# EAGLE design max485 (EAGLE 6.1)
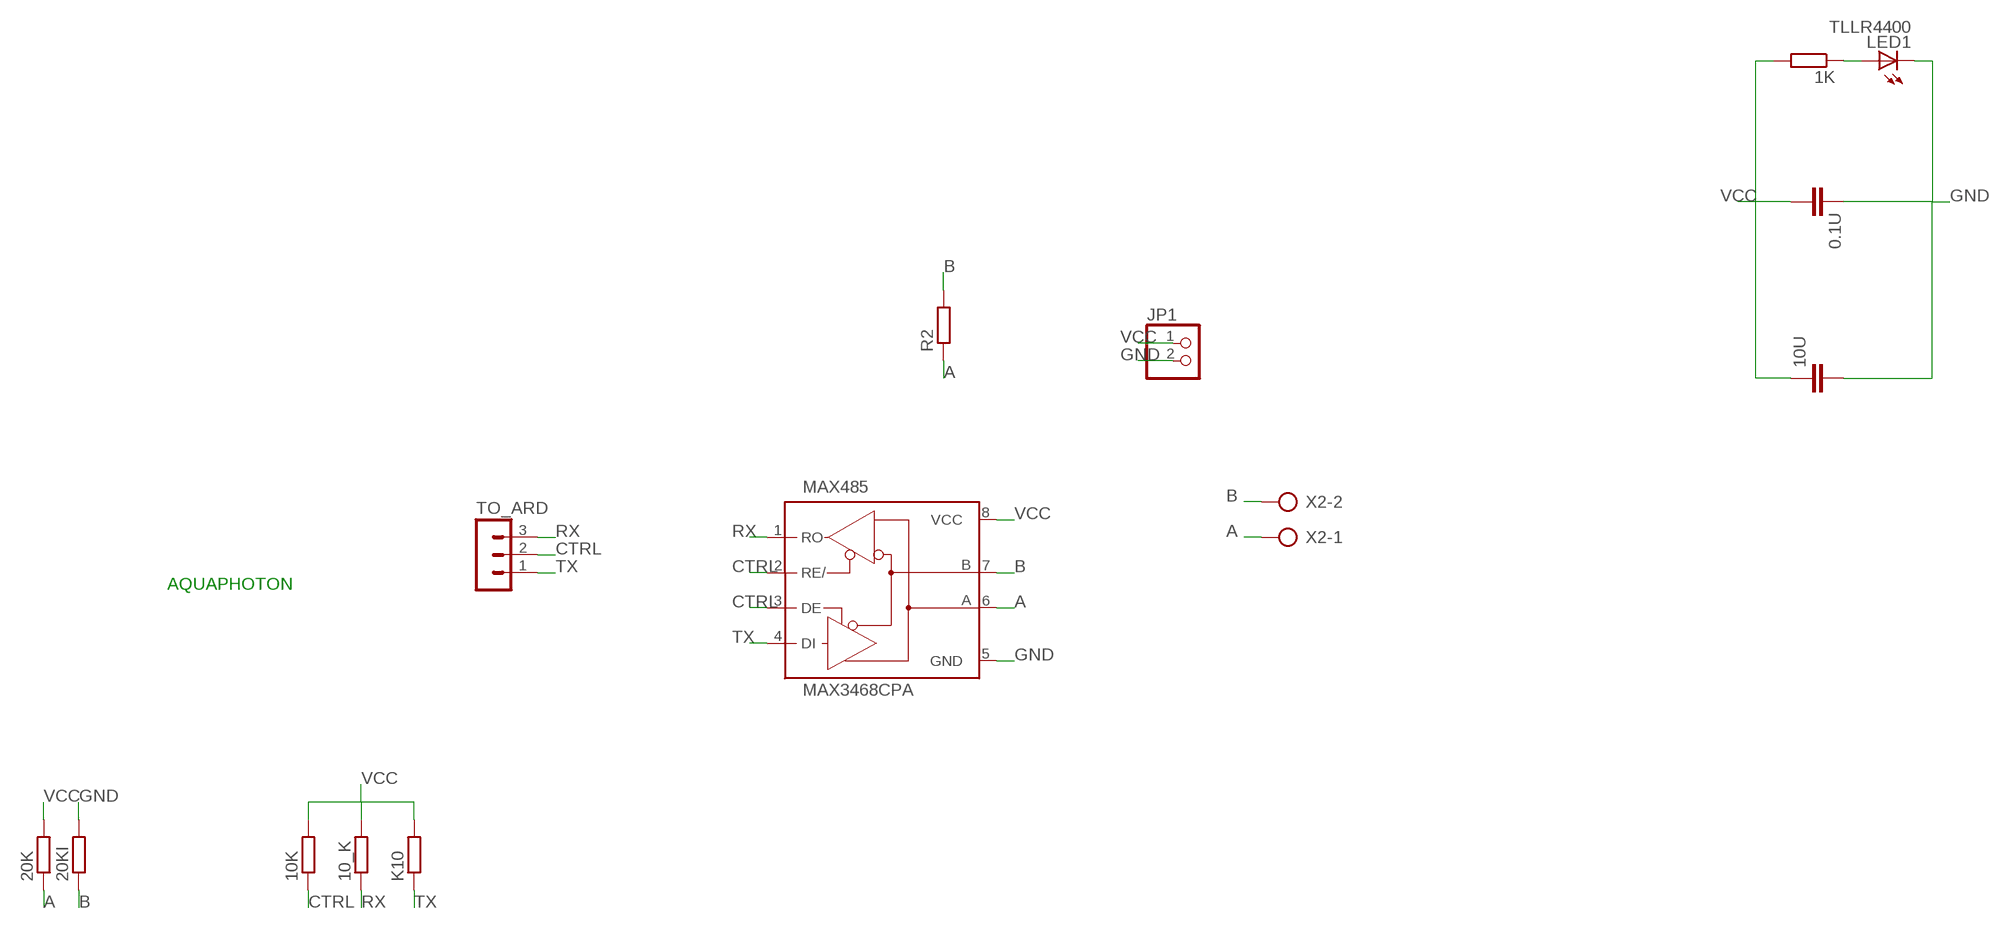
[diagram p0: schematic, sheet 1]

## Parts
0.1U  C5/2.5  [C5B2.5]
1K  R-EU_0207/10  [0207/10]
10_K  R-EU_0207/10  [0207/10]
10K  R-EU_0207/10  [0207/10]
10U  C5/2.5  [C5B2.5]
20K  R-EU_0207/10  [0207/10]
20KI  R-EU_0207/10  [0207/10]
JP1  PINHD-1X2  [1X02]
K10  R-EU_0207/10  [0207/10]
LED1  TLLR4400  [LED3MM]
MAX485  MAX3468CPA  [DIL08]
R2  R-EU_0207/10  [0207/10]
TO_ARD  MA03-1  [MA03-1]
X2  AK500/2-H  [AK500/2-H]

## Nets
A: 20K.1 MAX485.6(A) R2.1 X2.1
B: 20KI.1 MAX485.7(B) R2.2 X2.2
CTRL: 10K.1 MAX485.2(RE/) MAX485.3(DE) TO_ARD.2
GND: 0.1U.1 10U.2 20KI.2 JP1.2 LED1.K(C) MAX485.5(GND)
N$2: 1K.1 LED1.A
RX: 10_K.1 MAX485.1(RO) TO_ARD.3
TX: K10.1 MAX485.4(DI) TO_ARD.1
VCC: 0.1U.2 1K.2 10_K.2 10K.2 10U.1 20K.2 JP1.1 K10.2 MAX485.8(VCC)

## Notes on the sheet
- AQUAPHOTON

## Library data of the parts
0.1U 10U = capacitor-wima:C: CAPACITOR naming: grid - package width
1K 10_K 10K 20K 20KI K10 R2 = rcl:R-EU_: RESISTOR, European symbol
JP1 = pinhead:PINHD-1X2: PIN HEADER
LED1 = led:TLLR4400: Low Current (2mA) LED 3 mm Tinted Diffused Package color RED Source: Data sheet <http://www.farnell.com/datasheets/391100.pdf>; MF: VISHAY SEMICONDUCTOR; OC_FARNELL: 1612437
MAX485 = maxim:MAX34*: +5V, Fail-Safe, 40Mbps, Profibus RS-485/RS-422 Transceivers Source: MAX3465-MAX3469.pdf; OC_FARNELL: unknown; OC_NEWARK: unknown
TO_ARD = con-lstb:MA03-1: PIN HEADER; OC_FARNELL: unknown; OC_NEWARK: unknown
X2 = con-ptr500:AK500/2-H: CONNECTOR Aug. 2004 / PTR Meßtechnik: Die Bezeichnung der Serie AK505 wurde geändert. Es handelt sich hierbei um AK500 in horizontaler Ausführung.; OC_FARNELL: unknown; OC_NEWARK: unknown

## Board
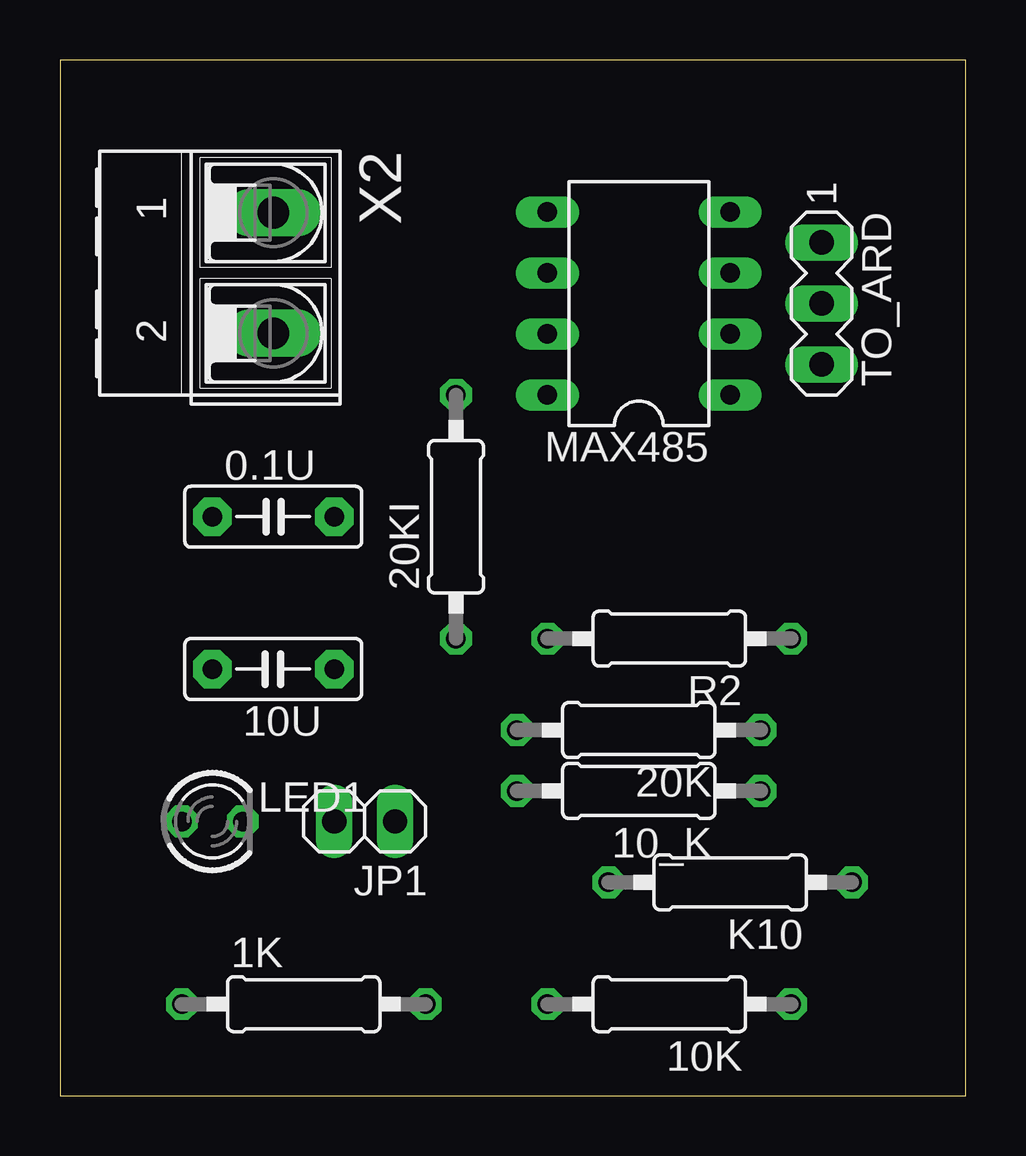
[diagram p1: board, top side]
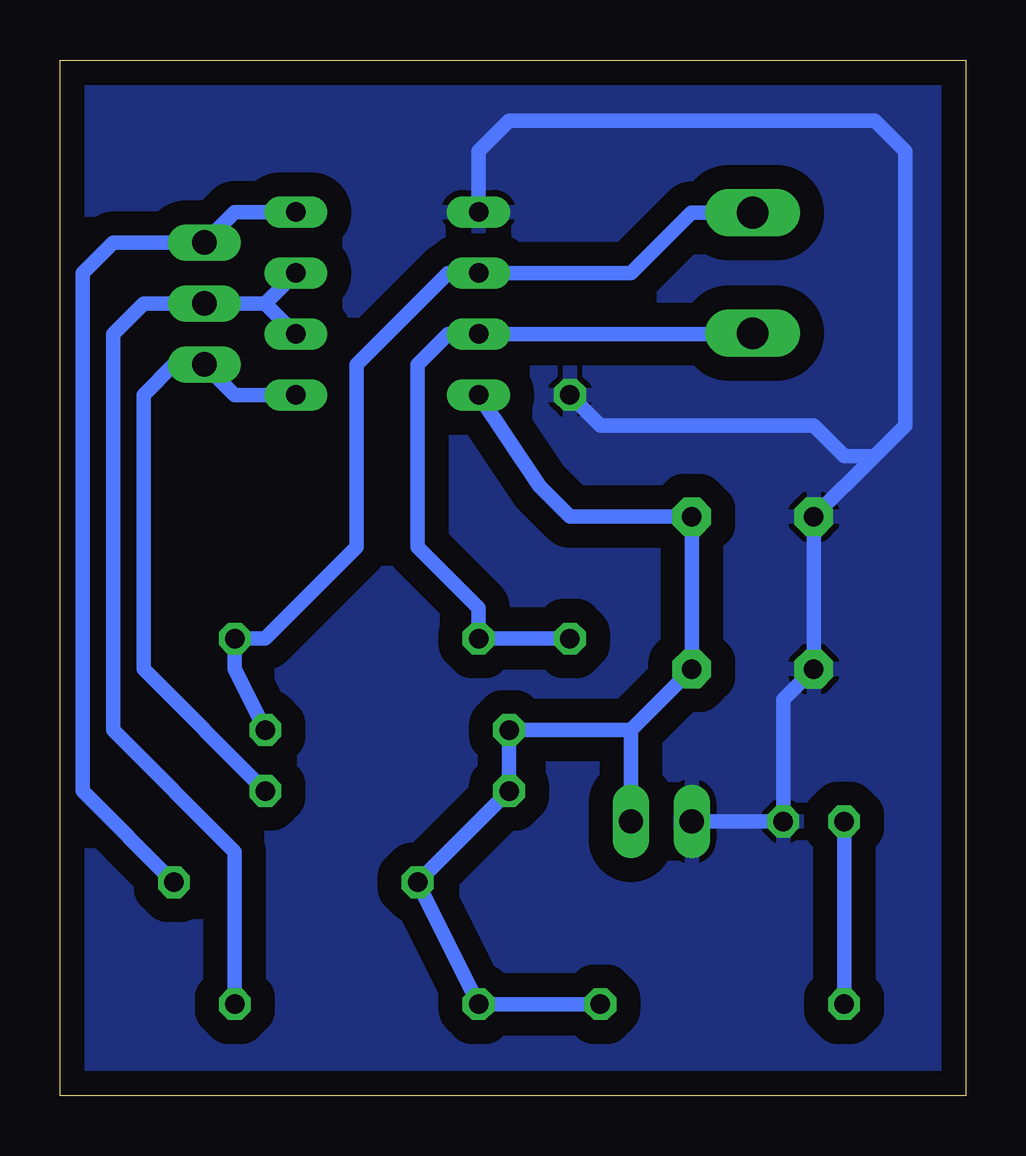
[diagram p2: board, bottom side, seen from below]

Size 37.77 x 43.17 mm. Coordinates in mm from the lower left corner, seen from the top.
Outline: 0,0 37.77,0 37.77,43.17 0,43.17 0,0
Copper layers (1*16): Top 0.5mm / dielectric 1.5mm / Bottom 0.035mm
Design rules: minimum track width 10mil, minimum drill 24mil, track to track 1mm, track to pad 1mm, pad to pad 1mm, via to via 1mm, smd to smd 1mm, copper to edge 40mil, drill to drill 8mil, minimum pad ring 10mil, minimum via ring 8mil, stop-mask expansion 4mil, vias tented up to drill 0mil, thermal gap 10mil

### Footprints (pad centres in the part's own frame; a part is rotated, then mirrored left to right if it is on the bottom)
C5B2.5 = drill 0.813 pad 1.6 octagon: 1 -2.54,0; 2 2.54,0
0207/10 = drill 0.813 octagon: 1 -5.08,0; 2 5.08,0
1X02 = drill 1.016 long: 1 -1.27,0; 2 1.27,0
LED3MM = drill 0.813 octagon: A -1.27,0; K 1.27,0
DIL08 = drill 0.813 long: 1 -3.81,-3.81; 2 -1.27,-3.81; 3 1.27,-3.81; 4 3.81,-3.81; 5 3.81,3.81; 6 1.27,3.81; 7 -1.27,3.81; 8 -3.81,3.81
MA03-1 = drill 1.016 long: 1 -2.54,0; 2 0,0; 3 2.54,0
AK500/2-H = drill 1.321 long: 1 -2.515,0; 2 2.515,0

### Placement (x,y rotation side)
0.1U  8.89,24.13 0 top
1K  10.16,3.81 0 top
10_K  24.13,12.7 180 top
10K  25.4,3.81 180 top
10U  8.89,17.78 180 top
20K  24.13,15.24 180 top
20KI  16.51,24.13 90 top
JP1  12.7,11.43 180 top
K10  27.94,8.89 180 top
LED1  6.35,11.43 0 top
MAX485  24.13,33.02 90 top
R2  25.4,19.05 180 top
TO_ARD  31.75,33.02 270 top
X2  8.89,34.29 270 top

### Tracks (layer width: path | path; a pad name or v marks a point on that pad's centre or on a via)
A
  Bottom 0.61: X2.1 11.46,36.81 13.97,34.29 MAX485.6 21.59,34.29 25.4,30.48 25.4,22.86 29.21,19.05 R2.1 30.48,17.78 20K.1
B
  Bottom 0.61: 20KI.1 R2.2 20.32,20.32 22.86,22.86 22.86,30.48 21.59,31.75 MAX485.7 10.16,31.75 10.13,31.78 X2.2
CTRL
  Bottom 0.61: MAX485.2 29.21,33.02 | 29.21,33.02 TO_ARD.2 34.29,33.02 35.56,31.75 35.56,15.24 30.48,10.16 10K.1 | MAX485.3 29.21,33.02
GND
  Bottom 0.61: MAX485.5 20.32,39.37 19.05,40.64 3.81,40.64 2.54,39.37 2.54,27.94 3.81,26.67 | 3.81,26.67 0.1U.1 10U.2 7.62,16.51 LED1.K JP1.2 | 20KI.2 15.24,27.94 6.35,27.94 5.08,26.67 3.81,26.67
  pour Bottom: 0,0 0,43.18 38.1,43.18 38.1,0
N$2
  Bottom 0.61: 1K.1 LED1.A
RX
  Bottom 0.61: MAX485.1 30.48,29.21 TO_ARD.3 33.02,30.48 34.29,29.21 34.29,17.78 10_K.1
TX
  Bottom 0.61: MAX485.4 30.48,36.83 TO_ARD.1 35.56,35.56 36.83,34.29 36.83,12.7 K10.1
VCC
  Bottom 0.61: 1K.2 10K.2 K10.2 10_K.2 20K.2 13.97,15.24 | JP1.1 13.97,15.24 | 13.97,15.24 10U.1 0.1U.2 16.51,24.13 17.78,25.4 MAX485.8